# Altium schematic sheet Power.SchDoc: PULP - shield - GAP
size A4; Revision: 1.1; SheetNumber: 2; SheetTotal: 2
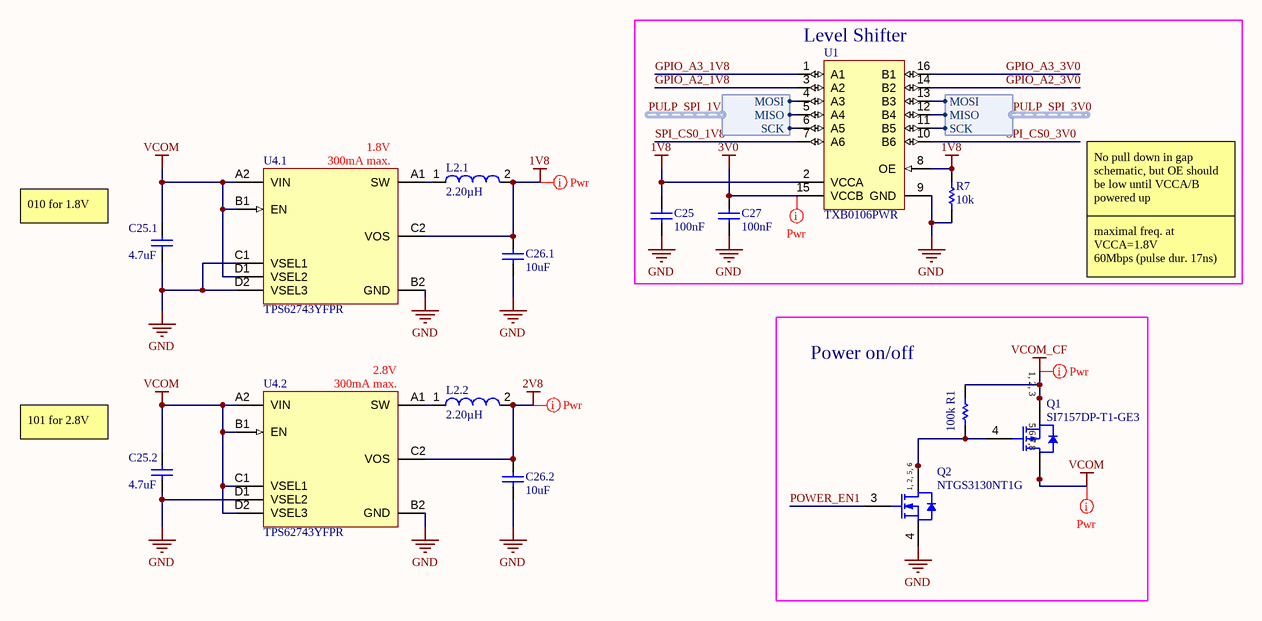
[diagram p0: Power.SchDoc]

## Parts
C25  100nF  [CAPC0402(1005)60_N]
C25.1  4.7uF  [CAPC0402(1005)60_N]
C25.2  4.7uF  [CAPC0402(1005)60_N]
C26.1  10uF  [CAPC0402(1005)60_N]
C26.2  10uF  [CAPC0402(1005)60_N]
C27  100nF  [CAPC0402(1005)60_N]
L2.1  Inductance: 2.20µH  [SMD 0805_A]  (hidden comment: 74479775222)
L2.2  Inductance: 2.20µH  [SMD 0805_A]  (hidden comment: 74479775222)
Q1  SI7157DP-T1-GE3  [PowerPAK_SO-8_V]
Q2  NTGS3130NT1G  [ONSC-TSOP-6-318G-02_V]
R1  100k  [RESC1609X50X30NL8T20]
R7  10k  [RESC1005X40X25NL05T05]
U1  TXB0106PWR  [PW0016A_L]
U4.1  TPS62743YFPR  [YFP0008AAAA]
U4.2  TPS62743YFPR  [YFP0008AAAA]

## Blocks framed on the sheet
Level Shifter: C25 C27 R7 U1
Power on/off: Q1 Q2 R1

## Harnesses
SPI: SCK, MISO, MOSI

## Nets
1V8: C25.2 C26.1.2 L2.1.2 R7.2 U1.2(VCCA) U1.8(OE) U4.1.C2(VOS)
2V8: C26.2.2 L2.2.2 U4.2.C2(VOS)
3V0: C27.1 U1.15(VCCB)
GND: C25.1 C25.1.1 C25.2.1 C26.1.1 C26.2.1 C27.2 Q2.4(S) R7.1 U1.9(GND) U4.1.B2(GND) U4.1.C1(VSEL1) U4.1.D2(VSEL3) U4.2.B2(GND) U4.2.D1(VSEL2)
VCOM: C25.1.2 C25.2.2 Q1.5(D) Q1.6(D) Q1.7(D) Q1.8(D) U4.1.A2(VIN) U4.1.B1(EN) U4.1.D1(VSEL2) U4.2.A2(VIN) U4.2.B1(EN) U4.2.C1(VSEL1) U4.2.D2(VSEL3)
VCOM_CF: Q1.1(S) Q1.2(S) Q1.3(S) R1.2
GPIO_A2_1V8: U1.3(A2)
GPIO_A2_3V0: U1.14(B2)
GPIO_A3_1V8: U1.1(A1)
GPIO_A3_3V0: U1.16(B1)
POWER_EN1: Q2.3(G)
PULP_SPI_1V8.MISO: U1.5(A4) ; harness SPI.MISO
PULP_SPI_1V8.MOSI: U1.4(A3) ; harness SPI.MOSI
PULP_SPI_1V8.SCK: U1.6(A5) ; harness SPI.SCK
PULP_SPI_3V0.MISO: U1.12(B4) ; harness SPI.MISO
PULP_SPI_3V0.MOSI: U1.13(B3) ; harness SPI.MOSI
PULP_SPI_3V0.SCK: U1.11(B5) ; harness SPI.SCK
SPI_CS0_1V8: U1.7(A6)
SPI_CS0_3V0: U1.10(B6)
NetL2.1_1: L2.1.1 U4.1.A1(SW)
NetL2.2_1: L2.2.1 U4.2.A1(SW)
NetQ1_4: Q1.4(G) Q2.1(D) Q2.2(D) Q2.5(D) Q2.6(D) R1.1

## Layout directives
net class POWER: 1V8, 2V8, 3V0, VCOM, VCOM_CF

## Notes on the sheet
- (near U4.1) 1.8V
- (near U4.1) 300mA max.
- No pull down in gap schematic, but OE should be low until VCCA/B powered up
- 010 for 1.8V
- maximal freq. at VCCA=1.8V
  60Mbps (pulse dur. 17ns)
- (near U4.2) 2.8V
- (near U4.2) 300mA max.
- 101 for 2.8V
- 1
- 2
- 3
- 4
- A
- B
- C
- Project:
- D
- Date:
- Drawing number:
- Rev:
- Format:
- A4 Q
- Drawn by:
- Laboratory:
- Page
- Sheet:
- of
- File:
- (in symbol CMP-1058-00957-1) 1, 2, 5, 6
- (in symbol CMP-01116-1) 1, 2, 3; 5,6 7,8

## Library data of the parts
C25 C27 = CMP-1034-02065-1: CAP 100nF 10V ±10% 0402 (1005 Metric) Thickness 0.6mm SMD; Case-EIA: 0402; Case-Metric: 1005; Tolerance: Â±10%; Max Thickness: 0.6 mm; Value: 100nF; Rated Voltage: 10 V; Technology: SMT
C25.1 C25.2 = CMP-1034-02137-1: CAP 4.7uF 6.3V ±20% 0402 (1005 Metric) Thickness 0.6mm SMD; Case-Metric: 1005; Case-EIA: 0402; Tolerance: Â±20%; Technology: SMT; Max Thickness: 0.6 mm; Rated Voltage: 6.3 V; Value: 4.7uF
C26.1 C26.2 = CMP-1034-02138-1: CAP 10uF 6.3V ±20% 0402 (1005 Metric) Thickness 0.6mm SMD; Case-Metric: 1005; Case-EIA: 0402; Tolerance: Â±20%; Rated Voltage: 6.3 V; Technology: SMT; Max Thickness: 0.6 mm; Value: 10uF
L2.1 L2.2 = CMP-1392-00029-1: Power Multilayer Inductor WE-PMI, L=2.20 µH; Manufacturer: Wuerth Elektronik; ComponentLink2URL: http://katalog.we-online.de/kataloge/eisos/media/pdf/74479775222A.pdf; ComponentLink1Description: Manufacturer URL; ComponentLink2Description: Datasheet; ComponentLink1URL: http://www.we-online.com; PartNumber: 74479775222; PackageReference: SMD 0805_A
Q1 = CMP-01116-1: MOSFET, P CHANNEL, -20V, -60A, POWERPAK SO-8; Turn-On Delay Time: 20ns; Max Power Dissipation: 104W; Rds On Max: 1.6mR; Number of Channels: 1; Rise Time: 14ns; Element Configuration: Single; Gate to Source Voltage (Vgs): 12V; Fall Time: 55ns; Threshold Voltage: -1.4V; Power Dissipation: 6.25W; Drain to Source Resistance: 1.25mR; Drain to Source Voltage (Vdss): 20V; Turn-Off Delay Time: 220ns; Input Capacitance: 22nF; Package Quantity: 3000; Number of Pins: 8; Max Operating Temperature: 150°C; Weight: 0.01787oz; Mount: Surface Mount; Drain to Source Breakdown Voltage: -20V; Number of Elements: 1; Continuous Drain Current (ID): -60A; Packaging: Tape and Reel; Lead Free: Lead Free; REACH SVHC: Unknown; Min Operating Temperature: -55°C; Radiation Hardening: No; Contact Plating: Tin,Matte
Q2 = CMP-1058-00957-1: Power MOSFET, 20 V, 5.6 A Single, N-Channel, 6-Pin TSOP, Pb-Free, Tape and Reel; Manufacturer: On Semiconductor; Channel Polarity: N Channel; Qrr Typ (nC): 8.8; V(BR)DSS Min (V): 20; VGS Max (V): 8; VGS(th) Max (V): 1.4; ComponentLink2URL: http://www.onsemi.com/pub_link/Collateral/NTGS3130N-D.PDF; ComponentLink1Description: Manufacturer URL; RoHS: Pb-Free; ComponentLink2Description: Datasheet; PackageVersion: Rev. V, 06/2012; ComponentLink3Description: Package Specification; ComponentLink1URL: http://www.onsemi.com/; ComponentLink3URL: http://www.onsemi.com/pub_link/Collateral/318G-02.PDF; PartNumber: NTGS3130NT1G; Configuration: Single; Mounting Technology: Surface Mount; PackageDescription: 6-Pin Small Outline Package, Body 3 x 1.5 mm, Pitch 0.95 mm; DatasheetVersion: Rev. 0; Package Type: TSOP-6; PackageReference: TSOP-6-318G-02; Packing: Tape and Reel
R1 = CMP-1666-00005-4: Chip Resistor, 10 KOhm, +/- 1%, 100 mW, -55 to 155 degC, 0603 (1608 Metric), RoHS, Tape and Reel; Manufacturer: Vishay Semiconductor; Voltage Rating: 75 V; Max Operating Temperature: 155 degC; PackageDescription: 2-Pin Surface Mount Device, Body 1.575 x 0.85 mm; ComponentLink1Description: Manufacturer URL; RoHSCompliant: true; PackageReference: 0603; REACH SVHC: Unknown; Length: 1.55 mm; DatasheetVersion: 06/2012; Packaging: Tape and Reel; Min Operating Temperature: -55 degC; Mounting Technology: Surface Mount; ComponentLink2URL: https://datasheet.ciiva.com/11809/0900766b80d98afc-11809037.pdf; Height: 0.45 mm; ComponentLink2Description: Datasheet; Package Quantity: 5000; ComponentLink1URL: http://www.vishay.com/
R7 = CMP-2002-00607-3: Chip Resistor, 10 KOhm, +/- 1%, 100 mW, -55 to 155 degC, 0402 (1005 Metric), RoHS, Tape and Reel; Manufacturer: Basic Passives; PartNumber: ERJ-2RKF1002X; Case\/Package: 0402; Resistance: 10 KOhm; Voltage Rating: 50 V; Power Rating: 100 mW; Packaging: Tape and Reel; Width: 0.5 mm; Package Quantity: 10000; Radiation Hardening: No; Min Operating Temperature: -55 degC; Case Code (Imperial): 0402; REACH SVHC: Yes; PackageDescription: 2-Pin Surface Mount Device, Body 1 x 0.5 mm; Length: 1 mm; ComponentLink1Description: Manufacturer URL; PackageReference: 0402; RoHSCompliant: true; ComponentLink1URL: http://www.panasonic.com/; Height: 0.35 mm; ComponentLink2Description: Datasheet; DatasheetVersion: 04/2015; Mounting Technology: Surface Mount; ComponentLink2URL: http://industrial.panasonic.com/cdbs/www-data/pdf/RDA0000/AOA0000C86.pdf; Max Operating Temperature: 155 degC; Pins: 2; Tolerance: 1%; Case Code (Metric): 1005; Mount: Surface Mount
U1 = CMP-2000-07336-1: 6-Bit Bidirectional Level-Shifting and Voltage Translator with Auto-Direction Sensing and +/- 15-kV ESD Protection, 1.2 to 3.6 V, -40 to 85 degC, 16-Pin TSSOP (PW), Green (RoHS & no Sb/Br), Tape and Reel; Manufacturer: Texas Instruments; Dynamic Catalog: TXBSeries; Differential - Input: Output:No/No; Number of Bits: 6; Output Type: Logic; Propagation Delay (Max): 4ns; Number of Outputs/Channel: 1; Voltage - Supply: 1.2V~3.6V,1.65V~5.5V; Data Rate: 100Mbps; Product Training Modules: VoltageLevelTranslation; Other Names: 296-23759-1; Logic Function: Translator,Bidirectional; Packaging: CutTape(CT); Datasheet URL: http://www.ti.com/general/docs/lit/getliterature.tsp?genericPartNumber=TXB0106&fileType=pdf; Package Description: 16-Pin Small Outline Package Integrated Circuit, Body 5 x 4.4 mm, Pitch 0.65 mm; Standard Package: 1; Series: -; Manufacturer URL: http://www.ti.com/; Operating Temperature: -40°C~85°C; Supplier Device Package: 16-TSSOP; Package Reference: PW16; Number of Channels: 6; Category: IntegratedCircuits(ICs); Package / Case: 16-TSSOP(0.173",4.40mmWidth); Family: Logic-Translators; Datasheet Version: Rev. B, 06/2015; Mounting Technology: SurfaceMount; Input Type: Logic
U4.1 U4.2 = CMP-00855-1: Buck Switching Regulator IC Positive Programmable 1.2V 1 Output 300mA 8-XFBGA, DSBGA; Number of Outputs: 1; Min Input Voltage: 2.15V; Max Input Voltage: 5.5V; Max Output Voltage: 3.3V; Switching Frequency: 1.2MHz; Synchronous Rectifier: Yes; Quiescent Current: 300nA; Mount: Surface Mount; Min Operating Temperature: -40°C; Max Operating Temperature: 85°C; Packaging: Tape and Reel; Min Output Voltage: 1.2V; Output Current: 300mA; Lead Free: Lead Free